# EAGLE design board (EAGLE 9.6.2)
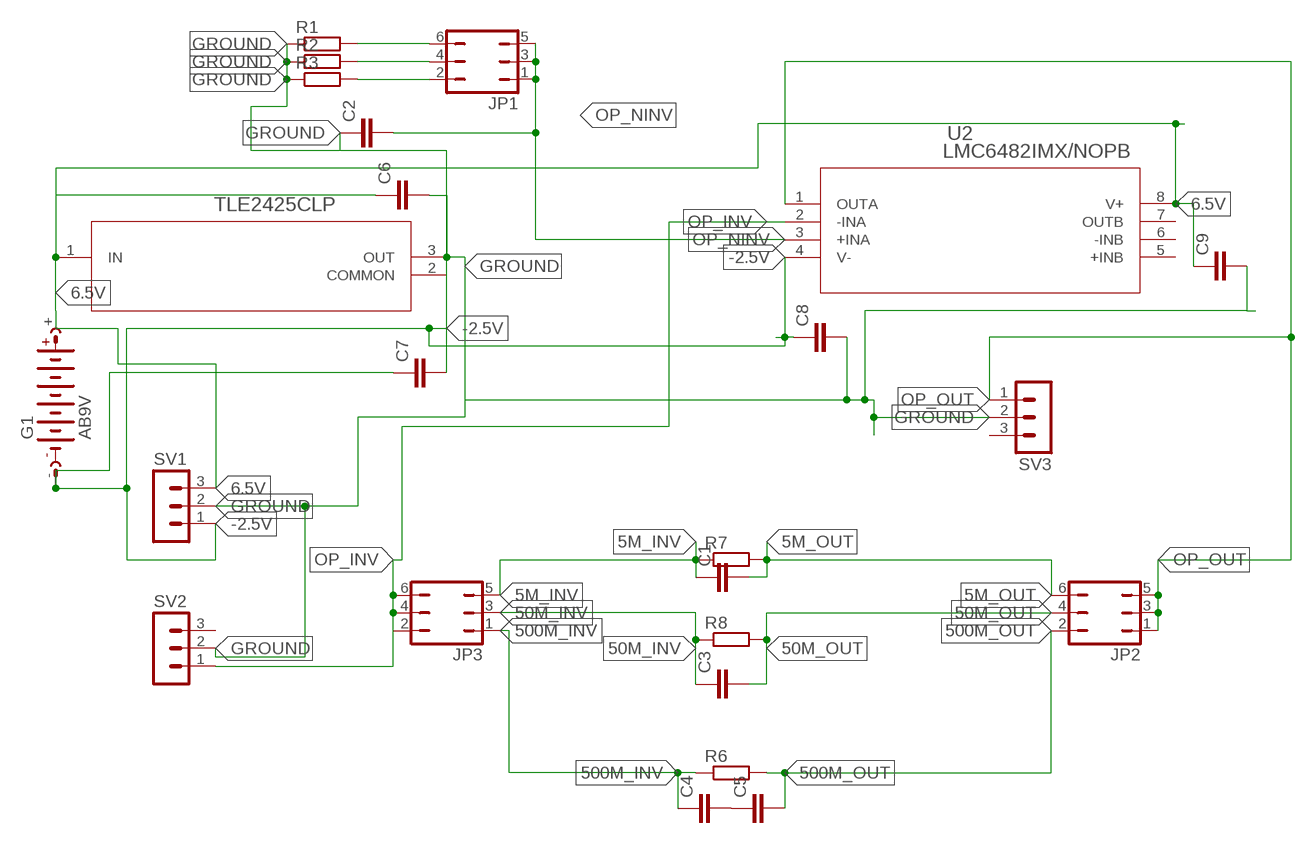
[diagram p0: schematic, sheet 1]

## Parts
C1  C-EUC0402  [C0402]
C2  C-EUC0805  [C0805]
C3  C-EUC0603  [C0603]
C4  C-EUC0603  [C0603]
C5  C-EUC0805  [C0805]
C6  C-EUC0402  [C0402]
C7  C-EUC0402  [C0402]
C8  C-EUC0402  [C0402]
C9  C-EUC0402  [C0402]
G1  AB9V  [AB9V]
JP1  JP3Q  [JP3Q]
JP2  JP3Q  [JP3Q]
JP3  JP3Q  [JP3Q]
R1  R-EU_R2010  [R2010]
R2  R-EU_R1206  [R1206]
R3  R-EU_R2512  [R2512]
R6  R-EU_R2010  [R2010]
R7  R-EU_R2512  [R2512]
R8  R-EU_R1206  [R1206]
SV1  MA03-1  [MA03-1]
SV2  MA03-1  [MA03-1]
SV3  MA03-1  [MA03-1]
U1  TLE2425CLP  [LP3]
U2  LMC6482IMX/NOPB  [M08A]

## Nets
5M_INV: C1.1 JP3.5 R7.1
5M_OUT: C1.2 JP2.6 R7.2
6.5V: C6.1 C9.1 G1.+ SV1.3 U1.1(IN) U2.8(V+)
50M_INV: C3.1 JP3.3 R8.1
50M_OUT: C3.2 JP2.4 R8.2
500M_INV: C4.1 JP3.1 R6.1
500M_OUT: C5.2 JP2.2 R6.2
-2.5V: C7.1 C8.1 G1.- SV1.1 U1.2(COMMON) U2.4(V-)
GROUND: C2.1 C6.2 C7.2 C8.2 C9.2 R1.1 R2.1 R3.1 SV1.2 SV2.2 SV3.2 U1.3(OUT)
N$1: C4.2 C5.1
N$2: JP1.2 R3.2
N$3: JP1.4 R2.2
N$4: JP1.6 R1.2
OP_INV: JP3.2 JP3.4 JP3.6 SV2.1 U2.2(-INA)
OP_NINV: C2.2 JP1.1 JP1.3 JP1.5 U2.3(+INA)
OP_OUT: JP2.1 JP2.3 JP2.5 SV3.1 U2.1(OUTA)
Unconnected: SV2.3 SV3.3 U2.5(+INB) U2.6(-INB) U2.7(OUTB)

## Library data of the parts
C1-C9 = rcl:C-EU: CAPACITOR, European symbol; SPICEPREFIX: C
G1 = battery:AB9V: 9-V BATTERY CLIP
JP1-JP3 = jumper:JP3Q: JUMPER
R1-R3 R6-R8 = rcl:R-EU_: RESISTOR, European symbol; SPICEPREFIX: R
SV1-SV3 = con-lstb:MA03-1: PIN HEADER; OC_FARNELL: unknown; OC_NEWARK: unknown
U1 = vgr:TLE2425CLP; MANUFACTURER_PART_NUMBER: TLE2425CLP; VENDOR: Texas Instruments
U2 = opcorrect:LMC6482IMX/NOPB; MANUFACTURER_PART_NUMBER: LMC6482IMXNOPB; VENDOR: Texas Instruments

## Board
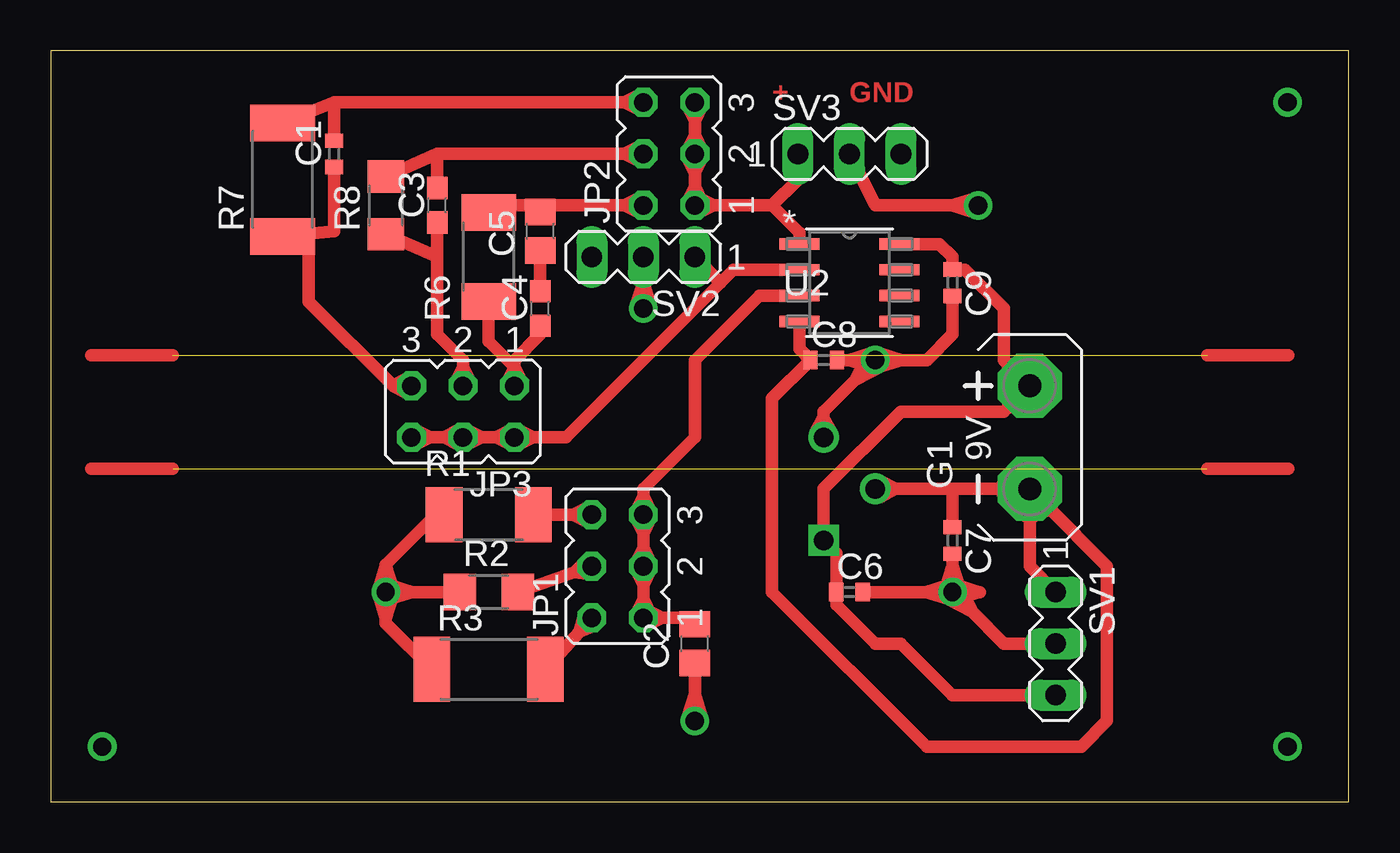
[diagram p1: board, top side]
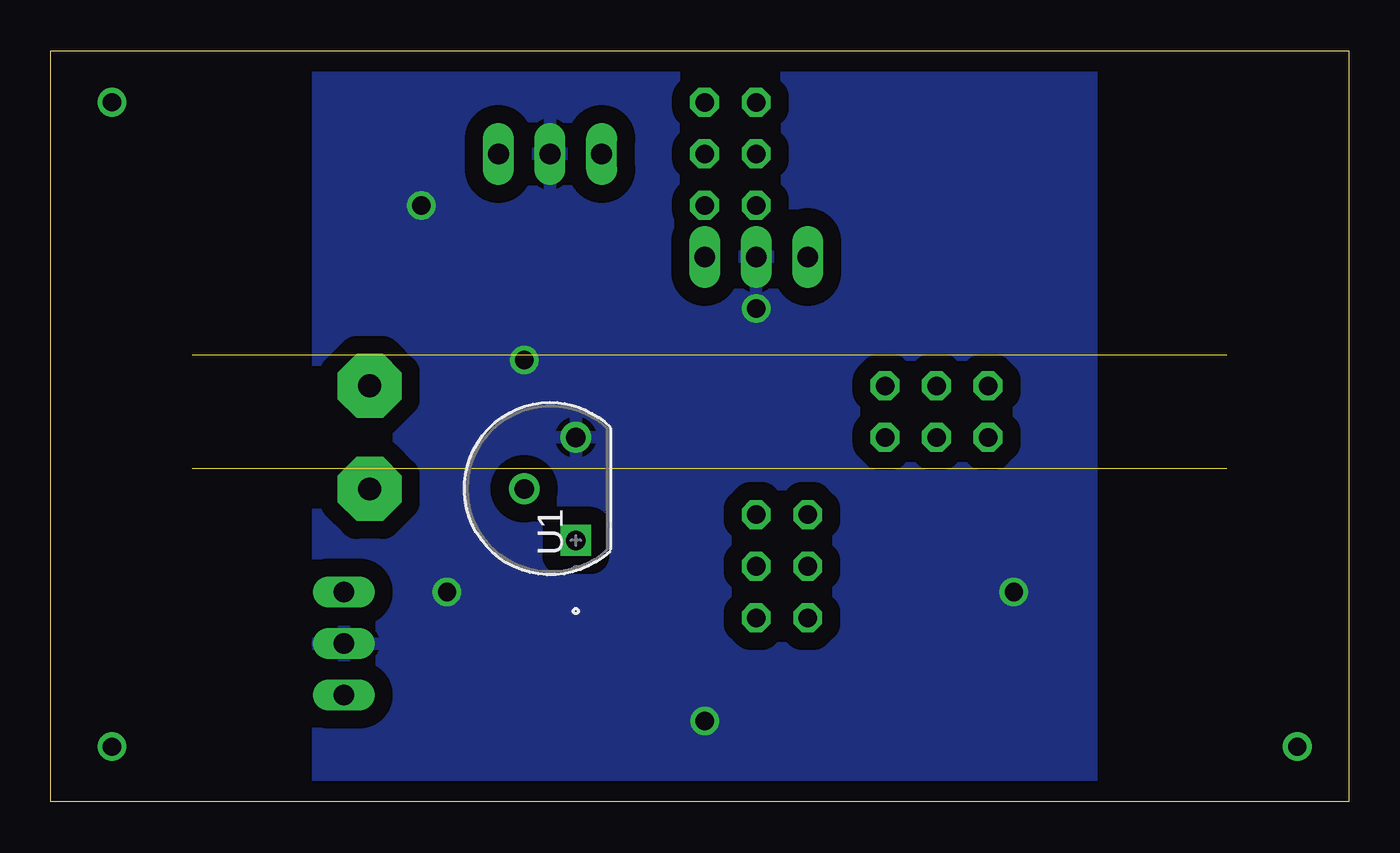
[diagram p2: board, bottom side, seen from below]

Size 63.98 x 37.01 mm. Coordinates in mm from the lower left corner, seen from the top.
Outline: 0,0 63.98,0 63.98,37.01 0,37.01 0,0
Copper layers (1*16): Top 0.035mm / dielectric 1.5mm / Bottom 0.035mm
Design rules "absolute_minimum_etchingdru": minimum track width 10mil, minimum drill 0.9mm, track to track 10mil, track to pad 10mil, pad to pad 10mil, via to via 10mil, smd to smd 6mil, copper to edge 40mil, drill to drill 6mil, minimum pad ring 10mil, minimum via ring 10mil, stop-mask expansion 4mil, vias tented up to drill 0mil, thermal gap 10mil

### Footprints (pad centres in the part's own frame; a part is rotated, then mirrored left to right if it is on the bottom)
C0402 = smd 0.7 x 0.9: 1 -0.65,0; 2 0.65,0
C0805 = smd 1.3 x 1.5: 1 -0.95,0; 2 0.95,0
C0603 = smd 1.1 x 1: 1 -0.85,0; 2 0.85,0
AB9V = drill 1.118 pad 3.15 octagon: + 0,2.54; - 0,-2.54
JP3Q = drill 0.914 octagon: 1 -2.54,-1.27; 2 -2.54,1.27; 3 0,-1.27; 4 0,1.27; 5 2.54,-1.27; 6 2.54,1.27
R2010 = smd 1.8 x 2.7: 1 -2.2,0; 2 2.2,0
R1206 = smd 1.6 x 1.803: 1 -1.422,0; 2 1.422,0
R2512 = smd 1.8 x 3.2: 1 -2.8,0; 2 2.8,0
MA03-1 = drill 1.016 long: 1 -2.54,0; 2 0,0; 3 2.54,0
LP3 = drill 0.965 pad 1.524 square: 1 -5.08,-2.54 | drill 0.965 pad 1.524: 2 -2.54,0; 3 0,-2.54
M08A = smd 1.981 x 0.559: 1 -2.464,1.905; 2 -2.464,0.635; 3 -2.464,-0.635; 4 -2.464,-1.905; 5 2.464,-1.905; 6 2.464,-0.635; 7 2.464,0.635; 8 2.464,1.905

### Placement (x,y rotation side)
C1  13.97,31.93 90 top
C2  31.75,7.8 90 top
C3  19.05,29.39 90 top
C4  24.13,24.31 90 top
C5  24.13,28.12 90 top
C6  39.37,10.34 0 top
C7  44.45,12.88 270 top
C8  38.1,21.77 0 top
C9  44.45,25.58 270 top
G1  48.26,17.96 0 top
JP1  27.94,11.61 90 top
JP2  30.48,31.93 90 top
JP3  20.32,19.23 180 top
R1  21.59,14.15 0 top
R2  21.59,10.34 0 top
R3  21.59,6.53 0 top
R6  21.59,26.85 90 top
R7  11.43,30.66 90 top
R8  16.51,29.39 90 top
SV1  49.53,7.8 270 top
SV2  29.21,26.85 180 top
SV3  39.37,31.93 0 top
U1  40.64,17.96 90 bottom
U2  39.37,25.58 0 top

### Tracks (layer width: path | path; a pad name or v marks a point on that pad's centre or on a via)
5M_INV
  Top 0.61: 16.87,20.5 JP3.5 | C1.1 13.97,28.12 12.71,27.99 | 12.71,27.99 R7.1 | 16.87,20.5 | 17.6,20.13 | JP3.5 17.6,20.13 | 16.87,20.5 17.6,20.13 | 17.6,20.86 | 17.6,20.86 16.87,20.5 | JP3.5 17.6,20.86 | 16.87,20.5 12.71,24.65 12.71,27.99 | 16.87,20.5 | 16.87,20.5 | 16.87,20.5 17.6,20.13 | 17.6,20.13 | 17.6,20.13 | JP3.5 17.6,20.13 | 16.87,20.5 17.6,20.86 | 16.87,20.5 17.6,20.13 | JP3.5 17.6,20.13 | 16.87,20.5 17.6,20.86 | 17.6,20.86 | JP3.5 17.6,20.86 | 16.87,20.5 17.6,20.13 | JP3.5 17.6,20.13 | 16.87,20.5 17.6,20.86 | JP3.5 17.6,20.86
5M_OUT
  Top 0.61: JP2.6 28.3,34.47 | 28.3,34.47 13.97,34.47 | C1.2 13.97,34.47 | R7.2 13.97,34.47 | 28.3,34.47 | 29.03,34.1 | JP2.6 29.03,34.1 | 28.3,34.47 29.03,34.1 | 28.3,34.47 29.03,34.83 | 29.03,34.83 | JP2.6 29.03,34.83 | 28.3,34.47 | 28.3,34.47 | 28.3,34.47 29.03,34.1 | 29.03,34.1 | 29.03,34.1 | JP2.6 29.03,34.1 | 28.3,34.47 29.03,34.83 | 28.3,34.47 29.03,34.1 | JP2.6 29.03,34.1 | 28.3,34.47 29.03,34.83 | 29.03,34.83 | JP2.6 29.03,34.83 | 28.3,34.47 29.03,34.1 | JP2.6 29.03,34.1 | 28.3,34.47 29.03,34.83 | JP2.6 29.03,34.83
6.5V
  Top 0.61: U2.8 43.81,27.48 44.45,26.85 C9.1 45.07,26.23 46.99,24.31 46.99,21.77 47.47,21.29 G1.+ 47.47,19.71 46.99,19.23 41.91,19.23 38.1,15.42 U1.1 38.72,12.26 C6.1 38.72,9.72 40.64,7.8 41.91,7.8 44.45,5.26 SV1.3
  Top 1.219: G1.+ 48.02,19.56 47.47,19.71 47.33,20.25 G1.+ | G1.+ 47.33,20.74 47.47,21.29 48.02,21.43 G1.+
50M_INV
  Top 0.61: 20.32,21.41 20.32,21.77 19.05,23.04 19.05,26.85 | 20.32,21.41 JP3.3 | C3.1 19.05,26.85 | R8.1 19.05,26.85 | 20.32,21.41 | 19.96,20.68 | JP3.3 19.96,20.68 | 20.32,21.41 19.96,20.68 | 20.32,21.41 20.68,20.68 | 20.68,20.68 | JP3.3 20.68,20.68 | 20.32,21.41 | 20.32,21.41 | 20.32,21.41 19.96,20.68 | 19.96,20.68 | 19.96,20.68 | JP3.3 19.96,20.68 | 20.32,21.41 20.68,20.68 | 20.32,21.41 19.96,20.68 | JP3.3 19.96,20.68 | 20.32,21.41 20.68,20.68 | 20.68,20.68 | JP3.3 20.68,20.68 | 20.32,21.41 19.96,20.68 | JP3.3 19.96,20.68 | 20.32,21.41 20.68,20.68 | JP3.3 20.68,20.68
50M_OUT
  Top 0.61: JP2.4 28.3,31.93 | 28.3,31.93 19.05,31.93 | 19.05,31.93 C3.2 | 19.05,31.93 R8.2 | 28.3,31.93 | 29.03,31.56 | JP2.4 29.03,31.56 | 28.3,31.93 29.03,31.56 | 28.3,31.93 29.03,32.29 | 29.03,32.29 | JP2.4 29.03,32.29 | 28.3,31.93 | 28.3,31.93 | 28.3,31.93 29.03,31.56 | 29.03,31.56 | 29.03,31.56 | JP2.4 29.03,31.56 | 28.3,31.93 29.03,32.29 | 28.3,31.93 29.03,31.56 | JP2.4 29.03,31.56 | 28.3,31.93 29.03,32.29 | 29.03,32.29 | JP2.4 29.03,32.29 | 28.3,31.93 29.03,31.56 | JP2.4 29.03,31.56 | 28.3,31.93 29.03,32.29 | JP2.4 29.03,32.29
500M_INV
  Top 0.61: 22.86,21.41 | 22.5,20.68 | JP3.1 22.5,20.68 | 22.86,21.41 22.5,20.68 | 22.86,21.41 23.22,20.68 | 23.22,20.68 | JP3.1 23.22,20.68 | 22.86,21.41 | 22.86,21.41 21.59,22.68 R6.1 | 22.86,21.41 22.86,21.77 24.13,23.04 C4.1 | 22.86,21.41 JP3.1 | 22.86,21.41 | 22.86,21.41 | 22.86,21.41 22.5,20.68 | 22.5,20.68 | JP3.1 22.5,20.68 | 22.86,21.41 23.22,20.68 | 23.22,20.68 | JP3.1 23.22,20.68 | 22.86,21.41 22.5,20.68 | 22.5,20.68 | JP3.1 22.5,20.68 | 22.86,21.41 23.22,20.68 | 22.86,21.41 22.5,20.68 | JP3.1 22.5,20.68 | 22.86,21.41 23.22,20.68 | JP3.1 23.22,20.68
500M_OUT
  Top 0.61: 28.3,29.39 24.45,29.39 C5.2 23.81,29.39 21.93,29.39 R6.2 | 28.3,29.39 JP2.2 | 28.3,29.39 | 29.03,29.02 | JP2.2 29.03,29.02 | 28.3,29.39 29.03,29.02 | 28.3,29.39 29.03,29.75 | 29.03,29.75 | JP2.2 29.03,29.75 | 28.3,29.39 | 28.3,29.39 | 28.3,29.39 29.03,29.02 | 29.03,29.02 | 29.03,29.02 | JP2.2 29.03,29.02 | 28.3,29.39 29.03,29.75 | 28.3,29.39 29.03,29.02 | JP2.2 29.03,29.02 | 28.3,29.39 29.03,29.75 | 29.03,29.75 | JP2.2 29.03,29.75 | 28.3,29.39 29.03,29.02 | JP2.2 29.03,29.02 | 28.3,29.39 29.03,29.75 | JP2.2 29.03,29.75
-2.5V
  Top 0.61: U2.4 36.91,22.31 C8.1 35.56,19.88 35.56,10.34 43.18,2.72 50.8,2.72 52.07,3.99 52.07,11.61 49.05,14.63 G1.- | SV1.1 48.26,11.61 48.26,14.3 G1.- | U1.2 41.6,15.42 | 41.6,15.42 | 41.6,15.42 44.45,15.42 | 44.45,15.42 47.14,15.42 G1.- | C7.1 44.45,15.42 | 41.6,15.42 40.86,15.82 | 40.86,15.82 | U1.2 40.86,15.82 | 41.6,15.42 40.86,15.01 | 40.86,15.01 | 41.6,15.42 40.86,15.82 | 40.86,15.82 | 41.6,15.42 40.86,15.82 | 40.86,15.82 | 41.6,15.42 | 40.86,15.01 | U1.2 40.86,15.01 | 41.6,15.42 40.86,15.82 | 40.86,15.82 | 41.6,15.42 | 41.6,15.42 40.86,15.01 | U1.2 40.86,15.01 | 41.6,15.42 40.86,15.82 | U1.2 40.86,15.82 | 41.6,15.42 40.86,15.01 | U1.2 40.86,15.01
  Top 1.219: G1.- 49.19,15.17 49.05,14.63 48.51,14.48 G1.- | G1.- 48.75,14.58 48.26,14.3 47.77,14.58 G1.- | G1.- 47.43,14.93 47.14,15.42 47.43,15.9 G1.-
GROUND  (via drill 0.9)
  Top 0.61: SV1.2 46.99,7.8 45.41,9.38 | U1.3 38.1,18.92 | 38.1,18.92 38.1,19.23 39.69,20.81 | SV2.2 29.21,25.66 | 29.21,25.66 | 29.21,25.66 v29.21,24.31 | 39.69,20.81 v40.64,21.77 | v40.64,21.77 41.99,21.77 | 45.41,9.38 v44.45,10.34 | v44.45,10.34 44.45,11.69 | 44.45,11.69 | 44.45,11.69 C7.2 | v44.45,10.34 43.1,10.34 | 43.1,10.34 | 43.1,10.34 C6.2 | C2.1 31.75,5.34 | 31.75,5.34 | 31.75,5.34 v31.75,3.99 | 45.41,9.38 44.26,9.98 | 44.8,10.52 | 44.26,9.98 | 45.41,9.38 | 45.41,9.38 44.8,10.52 | v44.45,10.34 44.8,10.52 | 45.41,9.38 | 45.41,9.38 44.26,9.98 | v44.45,10.34 44.26,9.98 | R2.1 17.86,10.34 | 17.86,10.34 v16.51,10.34 | 16.51,8.99 v16.51,10.34 | 16.51,11.69 v16.51,10.34 | 45.41,9.38 | 45.41,9.38 44.8,10.52 | 44.8,10.52 | 45.41,9.38 44.8,10.52 | v44.45,10.34 44.8,10.52 | 45.41,9.38 44.26,9.98 | 40.52,21.39 | v40.64,21.77 40.52,21.39 | 38.1,18.92 | 38.1,18.92 37.7,18.17 | 38.1,18.92 38.5,18.17 | 38.5,18.17 | U1.3 38.5,18.17 | R3.1 16.51,8.81 16.51,8.99 | 16.51,11.69 18.97,14.15 R1.1 | 41.99,21.77 43.18,21.77 44.45,23.04 C9.2 | v40.64,21.77 39.29,21.77 | 39.29,21.77 | 39.29,21.77 C8.2 | 38.1,18.92 | 38.5,18.17 | 38.1,18.92 37.7,18.17 | 37.7,18.17 | 38.1,18.92 | 38.1,18.92 38.5,18.17 | 38.5,18.17 | 38.1,18.92 37.7,18.17 | 37.7,18.17 | U1.3 37.7,18.17 | 38.1,18.92 38.5,18.17 | U1.3 38.5,18.17 | 38.1,18.92 37.7,18.17 | U1.3 37.7,18.17 | 38.1,18.92 38.5,18.17 | 38.5,18.17 | U1.3 38.5,18.17 | 38.1,18.92 37.7,18.17 | U1.3 37.7,18.17 | 38.1,18.92 38.5,18.17 | U1.3 38.5,18.17 | 29.21,25.66 28.83,24.43 | 29.21,25.66 29.59,24.43 | 40.83,21.41 | 39.69,20.81 40.29,21.95 | 40.29,21.95 | 39.69,20.81 40.83,21.41 | 40.83,21.41 | 40.29,21.95 | 40.76,22.15 | 40.76,21.39 | 39.29,21.77 40.52,21.39 | 39.29,21.77 40.52,22.15 | 44.45,11.69 44.07,10.46 | 44.45,11.69 44.83,10.46
  Top 0.61: 43.1,10.34 44.33,9.96 | 43.1,10.34 44.33,10.72 | 31.75,5.34 31.37,4.11 | 31.75,5.34 32.13,4.11 | 16.63,10.72 | 16.63,9.96 | 16.89,10.22 | 16.13,10.22 | 16.51,11.69 16.13,10.46 | 16.51,11.69 16.89,10.46 | 16.13,10.46 | 16.89,10.46 | SV3.2 40.64,29.39 44.37,29.39 | 44.37,29.39 v45.72,29.39 | 29.21,25.66 28.83,24.43 | 29.21,25.66 29.59,24.43 | 28.83,24.43 | 29.59,24.43 | 29.21,25.66 28.83,24.43 | 29.21,25.66 29.59,24.43 | 29.21,25.66 28.83,24.43 | v29.21,24.31 28.83,24.43 | 29.21,25.66 | 29.21,25.66 29.59,24.43 | v29.21,24.31 29.59,24.43 | 29.21,25.66 28.83,24.43 | 28.83,24.43 | v29.21,24.31 28.83,24.43 | 29.21,25.66 29.59,24.43 | 29.21,25.66 28.83,24.43 | v29.21,24.31 28.83,24.43 | 29.21,25.66 29.59,24.43 | v29.21,24.31 29.59,24.43 | 39.69,20.81 | 39.69,20.81 40.83,21.41 | v40.64,21.77 40.83,21.41 | 39.69,20.81 | 39.69,20.81 40.29,21.95 | v40.64,21.77 40.29,21.95 | 41.99,21.77 40.76,22.15 | 41.99,21.77 40.76,21.39 | 41.99,21.77 40.76,22.15 | v40.64,21.77 40.76,22.15 | 41.99,21.77 | 41.99,21.77 40.76,21.39 | v40.64,21.77 40.76,21.39 | 40.83,21.41 | 39.29,21.77 | 41.99,21.77 40.76,22.15 | 41.99,21.77 40.76,21.39 | 39.69,20.81 40.83,21.41 | v40.64,21.77 40.83,21.41 | 39.69,20.81 40.29,21.95 | 40.29,21.95 | 39.69,20.81 40.83,21.41 | v40.64,21.77 40.83,21.41 | 39.69,20.81 40.29,21.95 | v40.64,21.77 40.29,21.95 | 41.99,21.77 40.76,22.15 | v40.64,21.77 40.76,22.15 | 41.99,21.77 40.76,21.39 | v40.64,21.77 40.76,21.39 | 39.29,21.77 40.52,21.39 | 40.52,21.39 | v40.64,21.77 40.52,21.39 | 39.29,21.77 40.52,22.15 | 40.52,22.15 | v40.64,21.77 40.52,22.15 | 39.29,21.77 40.52,21.39 | 39.29,21.77 40.52,22.15 | 39.29,21.77 40.52,21.39 | v40.64,21.77 40.52,21.39 | 39.29,21.77 40.52,22.15 | v40.64,21.77 40.52,22.15
  Top 0.61: 44.45,11.69 44.07,10.46 | 44.45,11.69 44.83,10.46 | 43.1,10.34 44.33,9.96 | 43.1,10.34 44.33,10.72 | 44.07,10.46 | 44.83,10.46 | 44.33,9.96 | 44.33,10.72 | v44.45,10.34 44.57,10.72 45.8,10.34 44.57,9.96 v44.45,10.34 | 45.41,9.38 44.8,10.52 | v44.45,10.34 44.8,10.52 | 45.41,9.38 44.26,9.98 | v44.45,10.34 44.26,9.98 | 44.45,11.69 44.07,10.46 | 44.45,11.69 44.83,10.46 | 44.45,11.69 44.07,10.46 | v44.45,10.34 44.07,10.46 | 44.45,11.69 | 44.45,11.69 44.83,10.46 | v44.45,10.34 44.83,10.46 | 44.45,11.69 44.07,10.46 | 44.07,10.46 | v44.45,10.34 44.07,10.46 | 44.45,11.69 44.83,10.46 | 44.45,11.69 44.07,10.46 | v44.45,10.34 44.07,10.46 | 44.45,11.69 44.83,10.46 | v44.45,10.34 44.83,10.46 | 43.1,10.34 44.33,9.96 | 43.1,10.34 44.33,10.72 | 43.1,10.34 44.33,9.96 | v44.45,10.34 44.33,9.96 | 43.1,10.34 | 43.1,10.34 44.33,10.72 | v44.45,10.34 44.33,10.72 | 43.1,10.34 44.33,9.96 | 44.33,9.96 | v44.45,10.34 44.33,9.96 | 43.1,10.34 44.33,10.72 | 43.1,10.34 44.33,9.96 | v44.45,10.34 44.33,9.96 | 43.1,10.34 44.33,10.72 | v44.45,10.34 44.33,10.72 | 31.75,5.34 31.37,4.11 | 31.75,5.34 32.13,4.11 | 31.37,4.11 | 32.13,4.11 | 31.75,5.34 31.37,4.11 | 31.75,5.34 32.13,4.11 | 31.75,5.34 31.37,4.11 | v31.75,3.99 31.37,4.11 | 31.75,5.34 | 31.75,5.34 32.13,4.11 | v31.75,3.99 32.13,4.11 | 31.75,5.34 31.37,4.11 | 31.37,4.11 | v31.75,3.99 31.37,4.11 | 31.75,5.34 32.13,4.11 | 31.75,5.34 31.37,4.11 | v31.75,3.99 31.37,4.11 | 31.75,5.34 32.13,4.11 | v31.75,3.99 32.13,4.11 | 17.86,10.34 16.63,10.72 | 17.86,10.34 | 17.86,10.34 16.63,9.96 | 17.86,10.34 16.63,10.72 | v16.51,10.34 16.63,10.72 | 17.86,10.34 16.63,9.96 | v16.51,10.34 16.63,9.96 | 16.51,8.99 16.89,10.22 | 16.51,8.99 | 16.51,8.99 16.13,10.22 | 16.51,8.99 16.89,10.22 | v16.51,10.34 16.89,10.22
  Top 0.61: 16.51,8.99 16.13,10.22 | v16.51,10.34 16.13,10.22 | 16.51,11.69 16.13,10.46 | 16.51,11.69 | 16.51,11.69 16.89,10.46 | 16.51,11.69 16.13,10.46 | v16.51,10.34 16.13,10.46 | 16.51,11.69 | 16.51,11.69 16.89,10.46 | v16.51,10.34 16.89,10.46 | 17.86,10.34 16.63,10.72 | 17.86,10.34 16.63,9.96 | 17.86,10.34 16.63,10.72 | v16.51,10.34 16.63,10.72 | 17.86,10.34 16.63,9.96 | v16.51,10.34 16.63,9.96 | 16.51,8.99 16.89,10.22 | 16.51,8.99 16.13,10.22 | 16.51,8.99 16.89,10.22 | v16.51,10.34 16.89,10.22 | 16.51,8.99 16.13,10.22 | v16.51,10.34 16.13,10.22 | 16.51,11.69 16.13,10.46 | 16.51,11.69 16.89,10.46 | 16.51,11.69 16.13,10.46 | 16.13,10.46 | v16.51,10.34 16.13,10.46 | 16.51,11.69 16.89,10.46 | 16.51,11.69 16.13,10.46 | v16.51,10.34 16.13,10.46 | 16.51,11.69 16.89,10.46 | v16.51,10.34 16.89,10.46 | 44.37,29.39 45.6,29.01 v45.72,29.39 | 44.37,29.39 45.6,29.77 v45.72,29.39
  pour Bottom (isolate 0.889): 12.7,37.01 12.7,0.18 50.8,0.18 50.8,37.01
N$1
  Top 0.61: C4.2 C5.1
N$2
  Top 0.61: JP1.2 26.06,8.39 | 26.06,8.39 R3.2 | 26.06,8.39 26.82,8.69 | JP1.2 26.82,8.69 | 26.06,8.39 26.28,9.18 | 26.28,9.18 | 26.06,8.39 | 26.06,8.39 | 26.06,8.39 26.28,9.18 | JP1.2 26.28,9.18 | 26.06,8.39 26.82,8.69 | 26.82,8.69 | JP1.2 26.82,8.69 | 26.06,8.39 26.28,9.18 | 26.06,8.39 26.82,8.69 | JP1.2 26.82,8.69 | 26.06,8.39 26.28,9.18 | JP1.2 26.28,9.18
N$3
  Top 0.61: JP1.4 25.81,11.31 | 25.81,11.31 R2.2 | 25.81,11.31 26.62,11.2 JP1.4 | 25.81,11.31 26.38,11.89 JP1.4
N$4
  Top 0.61: JP1.6 25.76,14.15 | 25.76,14.15 R1.2 | 25.76,14.15 | 26.49,13.78 | JP1.6 26.49,13.78 | 25.76,14.15 26.49,13.78 | 25.76,14.15 26.49,14.51 | 26.49,14.51 | JP1.6 26.49,14.51 | 25.76,14.15 | 25.76,14.15 | 25.76,14.15 26.49,13.78 | 26.49,13.78 | 26.49,13.78 | JP1.6 26.49,13.78 | 25.76,14.15 26.49,14.51 | 25.76,14.15 26.49,13.78 | JP1.6 26.49,13.78 | 25.76,14.15 26.49,14.51 | 26.49,14.51 | JP1.6 26.49,14.51 | 25.76,14.15 26.49,13.78 | JP1.6 26.49,13.78 | 25.76,14.15 26.49,14.51 | JP1.6 26.49,14.51
N$5  (via drill 0.9)
  other vias: 2.54,2.72
N$6  (via drill 0.9)
  other vias: 60.96,2.72
N$7  (via drill 0.9)
  other vias: 60.96,34.47
N$8  (1 unrouted)
  Top 0.61: 2,22.01 6,22.01 | 57,22.01 61,22.01
N$9  (1 unrouted)
  Top 0.61: 2,16.41 6,16.41 | 57,16.41 61,16.41
OP_INV
  Top 0.61: JP3.6 18.69,17.96 | 18.69,17.96 | 18.69,17.96 19.41,17.96 | 19.41,17.96 JP3.4 | JP3.2 23.77,17.96 | JP3.4 21.23,17.96 | 21.23,17.96 | 21.23,17.96 21.95,17.96 | 21.95,17.96 JP3.2 | U2.2 33.66,26.21 33.02,25.58 | SV2.1 33.02,25.58 | 21.95,17.96 | 23.77,17.96 23.04,18.32 | 23.04,18.32 | JP3.2 23.04,18.32 | 23.77,17.96 23.04,17.59 | 23.04,17.59 | JP3.2 23.04,17.59 | 22.68,17.59 | JP3.2 22.68,17.59 | 21.95,17.96 22.68,17.59 | 21.95,17.96 22.68,18.32 | 22.68,18.32 | JP3.2 22.68,18.32 | 21.23,17.96 20.5,18.32 | 20.5,18.32 | JP3.4 20.5,18.32 | 21.23,17.96 20.5,17.59 | 20.5,17.59 | JP3.4 20.5,17.59 | 18.69,17.96 17.96,18.32 | 17.96,18.32 | JP3.6 17.96,18.32 | 18.69,17.96 17.96,17.59 | 17.96,17.59 | JP3.6 17.96,17.59 | 23.77,17.96 | 23.77,17.96 25.4,17.96 33.02,25.58 | 21.95,17.96 | 23.77,17.96 23.04,18.32 | 23.04,18.32 | 21.95,17.96 | 23.77,17.96 23.04,18.32 | JP3.2 23.04,18.32 | 23.77,17.96 | 23.04,17.59 | JP3.2 23.04,17.59 | 23.77,17.96 23.04,18.32 | 23.77,17.96 | 23.77,17.96 23.04,17.59 | JP3.2 23.04,17.59 | 23.77,17.96 23.04,18.32 | JP3.2 23.04,18.32 | 23.77,17.96 23.04,17.59 | JP3.2 23.04,17.59 | 21.95,17.96 22.68,17.59 | 22.68,17.59 | 22.68,17.59 | JP3.2 22.68,17.59 | 21.95,17.96 22.68,18.32 | 21.95,17.96 22.68,17.59 | JP3.2 22.68,17.59 | 21.95,17.96 22.68,18.32 | 22.68,18.32 | JP3.2 22.68,18.32 | 21.95,17.96 22.68,17.59 | JP3.2 22.68,17.59 | 21.95,17.96 22.68,18.32 | JP3.2 22.68,18.32 | 19.41,17.96 | 19.41,17.96 20.14,17.59 | JP3.4 20.14,17.59 | 19.41,17.96 | 19.41,17.96 20.14,18.32 | JP3.4 20.14,18.32 | 19.41,17.96 20.14,17.59 | 20.14,17.59 | JP3.4 20.14,17.59 | 19.41,17.96 20.14,18.32 | JP3.4 20.14,18.32 | 19.41,17.96 20.14,17.59 | JP3.4 20.14,17.59 | 19.41,17.96 20.14,18.32 | JP3.4 20.14,18.32 | 21.23,17.96 20.5,18.32 | 20.5,18.32
  Top 0.61: 21.23,17.96 20.5,18.32 | JP3.4 20.5,18.32 | 21.23,17.96 | 20.5,17.59 | JP3.4 20.5,17.59 | 21.23,17.96 20.5,18.32 | 21.23,17.96 | 21.23,17.96 20.5,17.59 | JP3.4 20.5,17.59 | 21.23,17.96 20.5,18.32 | JP3.4 20.5,18.32 | 21.23,17.96 20.5,17.59 | JP3.4 20.5,17.59 | 18.69,17.96 17.96,18.32 | 17.96,18.32 | 18.69,17.96 17.96,18.32 | JP3.6 17.96,18.32 | 18.69,17.96 | 17.96,17.59 | JP3.6 17.96,17.59 | 18.69,17.96 17.96,18.32 | 18.69,17.96 | 18.69,17.96 17.96,17.59 | JP3.6 17.96,17.59 | 18.69,17.96 17.96,18.32 | JP3.6 17.96,18.32 | 18.69,17.96 17.96,17.59 | JP3.6 17.96,17.59
OP_NINV
  Top 0.61: JP1.1 29.21,9.98 | 29.21,9.98 29.21,10.69 | 29.21,10.69 | 29.21,10.69 JP1.3 | JP1.5 29.21,13.23 | 29.21,13.23 | 29.21,13.23 29.21,12.52 | 29.21,12.52 JP1.3 | U2.3 34.92,24.94 31.75,21.77 31.75,17.96 29.21,15.42 29.21,15.06 | JP1.1 30.12,9.07 | 30.12,9.07 | 30.12,9.07 31.43,9.07 C2.2 | JP1.5 29.21,15.06 | 29.21,15.06 | 29.21,13.23 29.57,13.97 | 29.57,13.97 | JP1.5 29.57,13.97 | 29.21,13.23 28.85,13.97 | 28.85,13.97 | JP1.5 28.85,13.97 | 28.85,14.33 | JP1.5 28.85,14.33 | 29.21,15.06 28.85,14.33 | 29.21,15.06 29.57,14.33 | 29.57,14.33 | JP1.5 29.57,14.33 | 29.21,9.98 | 28.85,9.25 | JP1.1 28.85,9.25 | 29.21,9.98 28.85,9.25 | 29.21,9.98 29.57,9.25 | 29.57,9.25 | JP1.1 29.57,9.25 | 30.12,9.07 29.39,9.43 | 29.39,9.43 | JP1.1 29.39,9.43 | 30.12,9.07 29.39,8.7 | 29.39,8.7 | JP1.1 29.39,8.7 | 29.21,12.52 | 29.21,10.69 29.57,11.43 | 29.57,11.43 | JP1.3 29.57,11.43 | 29.21,10.69 28.85,11.43 | 28.85,11.43 | JP1.3 28.85,11.43 | 28.85,11.79 | JP1.3 28.85,11.79 | 29.21,12.52 28.85,11.79 | 29.21,12.52 29.57,11.79 | 29.57,11.79 | JP1.3 29.57,11.79 | 29.21,15.06 | 29.21,13.23 29.57,13.97 | 29.57,13.97 | 29.21,15.06 | 29.21,13.23 29.57,13.97 | JP1.5 29.57,13.97 | 29.21,13.23 | 28.85,13.97 | JP1.5 28.85,13.97 | 29.21,13.23 29.57,13.97 | 29.21,13.23 | 29.21,13.23 28.85,13.97 | JP1.5 28.85,13.97 | 29.21,13.23 29.57,13.97 | JP1.5 29.57,13.97 | 29.21,13.23 28.85,13.97 | JP1.5 28.85,13.97 | 29.21,15.06 28.85,14.33 | 28.85,14.33 | 28.85,14.33 | JP1.5 28.85,14.33 | 29.21,15.06 29.57,14.33 | 29.21,15.06 28.85,14.33 | JP1.5 28.85,14.33 | 29.21,15.06 29.57,14.33 | 29.57,14.33 | JP1.5 29.57,14.33 | 29.21,15.06 28.85,14.33 | JP1.5 28.85,14.33 | 29.21,15.06 29.57,14.33 | JP1.5 29.57,14.33 | 29.21,9.98 | 29.21,9.98 | 30.12,9.07 29.39,9.43 | 29.39,9.43 | 29.21,9.98 28.85,9.25
  Top 0.61: 28.85,9.25 | 28.85,9.25 | JP1.1 28.85,9.25 | 29.21,9.98 29.57,9.25 | 29.21,9.98 28.85,9.25 | JP1.1 28.85,9.25 | 29.21,9.98 29.57,9.25 | 29.57,9.25 | JP1.1 29.57,9.25 | 29.21,9.98 28.85,9.25 | JP1.1 28.85,9.25 | 29.21,9.98 29.57,9.25 | JP1.1 29.57,9.25 | 30.12,9.07 29.39,9.43 | JP1.1 29.39,9.43 | 30.12,9.07 | 29.39,8.7 | JP1.1 29.39,8.7 | 30.12,9.07 29.39,9.43 | 30.12,9.07 | 30.12,9.07 29.39,8.7 | JP1.1 29.39,8.7 | 30.12,9.07 29.39,9.43 | JP1.1 29.39,9.43 | 30.12,9.07 29.39,8.7 | JP1.1 29.39,8.7 | 29.21,12.52 | 29.21,10.69 29.57,11.43 | 29.57,11.43 | 29.21,12.52 | 29.21,10.69 29.57,11.43 | JP1.3 29.57,11.43 | 29.21,10.69 | 28.85,11.43 | JP1.3 28.85,11.43 | 29.21,10.69 29.57,11.43 | 29.21,10.69 | 29.21,10.69 28.85,11.43 | JP1.3 28.85,11.43 | 29.21,10.69 29.57,11.43 | JP1.3 29.57,11.43 | 29.21,10.69 28.85,11.43 | JP1.3 28.85,11.43 | 29.21,12.52 28.85,11.79 | 28.85,11.79 | 28.85,11.79 | JP1.3 28.85,11.79 | 29.21,12.52 29.57,11.79 | 29.21,12.52 28.85,11.79 | JP1.3 28.85,11.79 | 29.21,12.52 29.57,11.79 | 29.57,11.79 | JP1.3 29.57,11.79 | 29.21,12.52 28.85,11.79 | JP1.3 28.85,11.79 | 29.21,12.52 29.57,11.79 | JP1.3 29.57,11.79
OP_OUT
  Top 0.61: JP2.3 31.75,31.01 | 31.75,31.01 | 31.75,31.01 31.75,30.3 | 31.75,30.3 JP2.1 | JP2.1 32.66,29.39 | 32.66,29.39 | 32.66,29.39 35.56,29.39 | 35.56,29.39 36.91,28.04 U2.1 | JP2.5 31.75,33.55 | 31.75,33.55 | 31.75,33.55 31.75,32.84 | 31.75,32.84 JP2.3 | 35.56,29.39 36.83,30.66 SV3.1 | 31.75,30.3 | 31.39,29.57 | JP2.1 31.39,29.57 | 31.75,30.3 31.39,29.57 | 31.75,30.3 32.11,29.57 | 32.11,29.57 | JP2.1 32.11,29.57 | 32.66,29.39 31.93,29.75 | 31.93,29.75 | JP2.1 31.93,29.75 | 32.66,29.39 31.93,29.02 | 31.93,29.02 | JP2.1 31.93,29.02 | 31.75,32.84 | 31.75,31.01 32.11,31.75 | 32.11,31.75 | JP2.3 32.11,31.75 | 31.75,31.01 31.39,31.75 | 31.39,31.75 | JP2.3 31.39,31.75 | 31.39,32.11 | JP2.3 31.39,32.11 | 31.75,32.84 31.39,32.11 | 31.75,32.84 32.11,32.11 | 32.11,32.11 | JP2.3 32.11,32.11 | 31.75,33.55 32.11,34.29 | 32.11,34.29 | JP2.5 32.11,34.29 | 31.75,33.55 31.39,34.29 | 31.39,34.29 | JP2.5 31.39,34.29 | 31.75,30.3 | 31.75,30.3 | 32.66,29.39 31.93,29.75 | 31.93,29.75 | 31.75,30.3 31.39,29.57 | 31.39,29.57 | 31.39,29.57 | JP2.1 31.39,29.57 | 31.75,30.3 32.11,29.57 | 31.75,30.3 31.39,29.57 | JP2.1 31.39,29.57 | 31.75,30.3 32.11,29.57 | 32.11,29.57 | JP2.1 32.11,29.57 | 31.75,30.3 31.39,29.57 | JP2.1 31.39,29.57 | 31.75,30.3 32.11,29.57 | JP2.1 32.11,29.57 | 32.66,29.39 31.93,29.75 | JP2.1 31.93,29.75 | 32.66,29.39 | 31.93,29.02 | JP2.1 31.93,29.02 | 32.66,29.39 31.93,29.75 | 32.66,29.39 | 32.66,29.39 31.93,29.02 | JP2.1 31.93,29.02 | 32.66,29.39 31.93,29.75 | JP2.1 31.93,29.75 | 32.66,29.39 31.93,29.02 | JP2.1 31.93,29.02 | 31.75,32.84 | 31.75,31.01 32.11,31.75 | 32.11,31.75 | 31.75,32.84 | 31.75,31.01 32.11,31.75 | JP2.3 32.11,31.75 | 31.75,31.01 | 31.39,31.75 | JP2.3 31.39,31.75 | 31.75,31.01 32.11,31.75 | 31.75,31.01 | 31.75,31.01 31.39,31.75 | JP2.3 31.39,31.75
  Top 0.61: 31.75,31.01 32.11,31.75 | JP2.3 32.11,31.75 | 31.75,31.01 31.39,31.75 | JP2.3 31.39,31.75 | 31.75,32.84 31.39,32.11 | 31.39,32.11 | 31.39,32.11 | JP2.3 31.39,32.11 | 31.75,32.84 32.11,32.11 | 31.75,32.84 31.39,32.11 | JP2.3 31.39,32.11 | 31.75,32.84 32.11,32.11 | 32.11,32.11 | JP2.3 32.11,32.11 | 31.75,32.84 31.39,32.11 | JP2.3 31.39,32.11 | 31.75,32.84 32.11,32.11 | JP2.3 32.11,32.11 | 31.75,33.55 32.11,34.29 | 32.11,34.29 | 31.75,33.55 32.11,34.29 | JP2.5 32.11,34.29 | 31.75,33.55 | 31.39,34.29 | JP2.5 31.39,34.29 | 31.75,33.55 32.11,34.29 | 31.75,33.55 | 31.75,33.55 31.39,34.29 | JP2.5 31.39,34.29 | 31.75,33.55 32.11,34.29 | JP2.5 32.11,34.29 | 31.75,33.55 31.39,34.29 | JP2.5 31.39,34.29

### Text on the board
Top: + | GND
_tNames: SV3 | C1 | C3 | JP2 | R7 | R8 | C5 | C9 | SV2 | U2 | R6 | C4 | C8 | R1 | JP3 | G1 | C7 | R2 | SV1 | C6 | R3 | JP1 | C2
_bNames: U1